# EAGLE schematic Cooling_final (EAGLE 7.2.0)
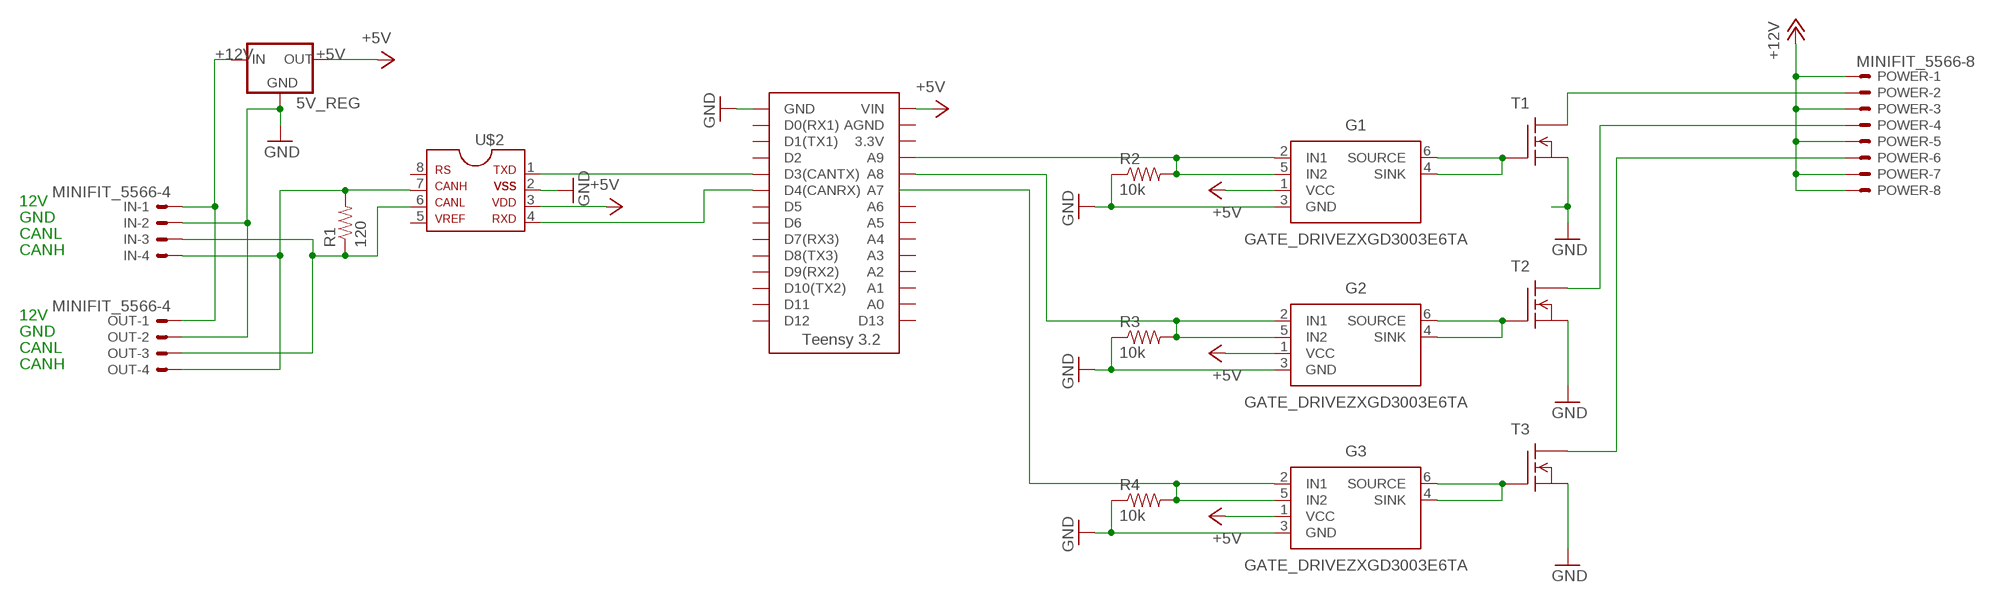
[diagram p0: schematic, sheet 1]

## Parts
5V_REG  5V_REGULATOR_LM340-NLM340MPX-5.0/NOPB  [SOT223]
G1  GATE_DRIVEZXGD3003E6TA  [SOT23-6]
G2  GATE_DRIVEZXGD3003E6TA  [SOT23-6]
G3  GATE_DRIVEZXGD3003E6TA  [SOT23-6]
IN  MINIFIT_5566-4  [MINIFIT_5566-4]
OUT  MINIFIT_5566-4  [MINIFIT_5566-4]
POWER  MINIFIT_5566-8  [MINIFIT_5566-8]
R1  120  RESISTOR0805-RES  [0805]
R2  10k  RESISTOR0805-RES  [0805]
R3  10k  RESISTOR0805-RES  [0805]
R4  10k  RESISTOR0805-RES  [0805]
T1  N-CHANNEL_MOSFETGENERIC  [TO-220-SINK]
T2  N-CHANNEL_MOSFETGENERIC  [TO-220-SINK]
T3  N-CHANNEL_MOSFETGENERIC  [TO-220-SINK]
U$1  TEENSY_3.2_SIMPLE  [TEENSY_3.2_SIMPLE]
U$2  MCP2551SOIC  [SOIC08]

## Nets
+5V: 5V_REG.2(OUT) 5V_REG.4(OUT) G1.1(VCC) G2.1(VCC) G3.1(VCC) U$1.VIN U$2.3
+12V: 5V_REG.3(IN) IN.1 OUT.1 POWER.1 POWER.3 POWER.5 POWER.7 POWER.8
GND: 5V_REG.1(GND) G1.3(GND) G2.3(GND) G3.3(GND) IN.2 OUT.2 R2.1 R3.1 R4.1 T1.3(S) T2.3(S) T3.3(S) U$1.GND U$2.2
N$1: G1.4(SINK) G1.6(SOURCE) T1.1(G)
N$2: U$1.D3(CANTX) U$2.1
N$3: U$1.D4(CANRX) U$2.4
N$4: G2.4(SINK) G2.6(SOURCE) T2.1(G)
N$5: U$2.6
N$6: G3.4(SINK) G3.6(SOURCE) T3.1(G)
N$7: POWER.2 T1.2(D)
N$8: IN.3 OUT.3 R1.1
N$9: POWER.4 T2.2(D)
N$10: POWER.6 T3.2(D)
N$11: IN.4 OUT.4 R1.2 U$2.7
N$18: G1.2(IN1) G1.5(IN2) R2.2 U$1.A9
N$19: G2.2(IN1) G2.5(IN2) R3.2 U$1.A8
N$20: G3.2(IN1) G3.5(IN2) R4.2
Unconnected: U$1.3.3V U$1.A0 U$1.A1 U$1.A2 U$1.A3 U$1.A4 U$1.A5 U$1.A6 U$1.A7 U$1.AGND U$1.D0(RX1) U$1.D1(TX1) U$1.D2 U$1.D5 U$1.D6 U$1.D7(RX3) U$1.D8(TX3) U$1.D9(RX2) U$1.D10(TX2) U$1.D11 U$1.D12 U$1.D13 U$2.5 U$2.8

## Notes on the sheet
- 12V
- GND
- CANL
- CANH
- 12V
- GND
- CANL
- CANH

## Library data of the parts
5V_REG = HyTechDevices:5V_REGULATOR_LM340-N: Voltage Regulator 5v linear voltage regulator Datasheet <http://www.mouser.com/ProductDetail/Texas-Instruments/LM340MPX-50-NOPB/?qs=X1J7HmVL2ZGZwtTFRQ9ItA%3D%3D> MAX current out: 1.5A MAX voltage in: 35V
G1-G3 = HyTechDevices:GATE_DRIVE: Gate drive for MOSFET transistors
IN OUT = HyTechDevices:MINIFIT_5566-4: Mini-Fit Junior connector 4 pole Source: http://www.molex.com; OC_FARNELL: unknown; OC_NEWARK: unknown
POWER = HyTechDevices:MINIFIT_5566-8: Mini-Fit Junior connector 8 pole Source: http://www.molex.com; OC_FARNELL: unknown; OC_NEWARK: unknown
R1-R4 = HyTechDevices:RESISTOR: Resistor Basic schematic elements and footprints for 0603, 1206, and PTH resistors.
T1-T3 = HyTechDevices:N-CHANNEL_MOSFET: Generic N-Channel MOSFET; _EXTERNAL_: 1
U$1 = HyTechDevices:TEENSY_3.2_SIMPLE: Simple version of the Teensy 3.2 board that only uses the 2 main rows of pins, not the inner pins or the pins opposite the usb port.
U$2 = HyTechDevices:MCP2551: MCP2551 High-Speed CAN Transceiver Product Webpage <https://www.microchip.com/wwwproducts/en/MCP2551> Datasheet <http://ww1.microchip.com/downloads/en/DeviceDoc/21667f.pdf> This device is outdated It is replaced by MCP2561. Comparison Page <https://www.microchip.com/wwwproducts/ProductCompare/MCP2551/MCP2561> Product Webpage <https://www.microchip.com/wwwproducts/en/MCP2561> Datasheet <http://ww1.microchip.com/downloads/en/DeviceDoc/20005167C.pdf>